# Altium schematic sheet Charger.SchDoc
size A4; SheetNumber: 4; SheetTotal: 6
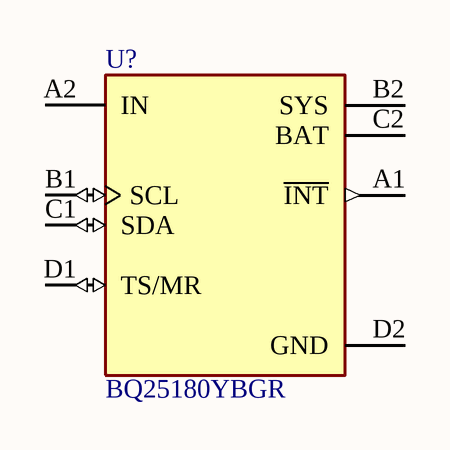
[diagram p0: Charger.SchDoc]

## Parts
U?  BQ25180YBGR  [IC_BQ25180YBGR]

## Nets

Not connected (* = marked no-connect by the designer): U? A1(~{INT}) A2(IN) B1(SCL) B2(SYS) C1(SDA) C2(BAT) D1(TS/MR) D2(GND)

## Library data of the parts
U? = BQ25180YBGR: MF: {'manufacturer': u'Texas Instruments'}; Package: None; Price: None; Value: *; MP: BQ25180YBGR; Availability: Unavailable